# EAGLE design n64cart-v2-soic-8 (EAGLE 9.6.2)
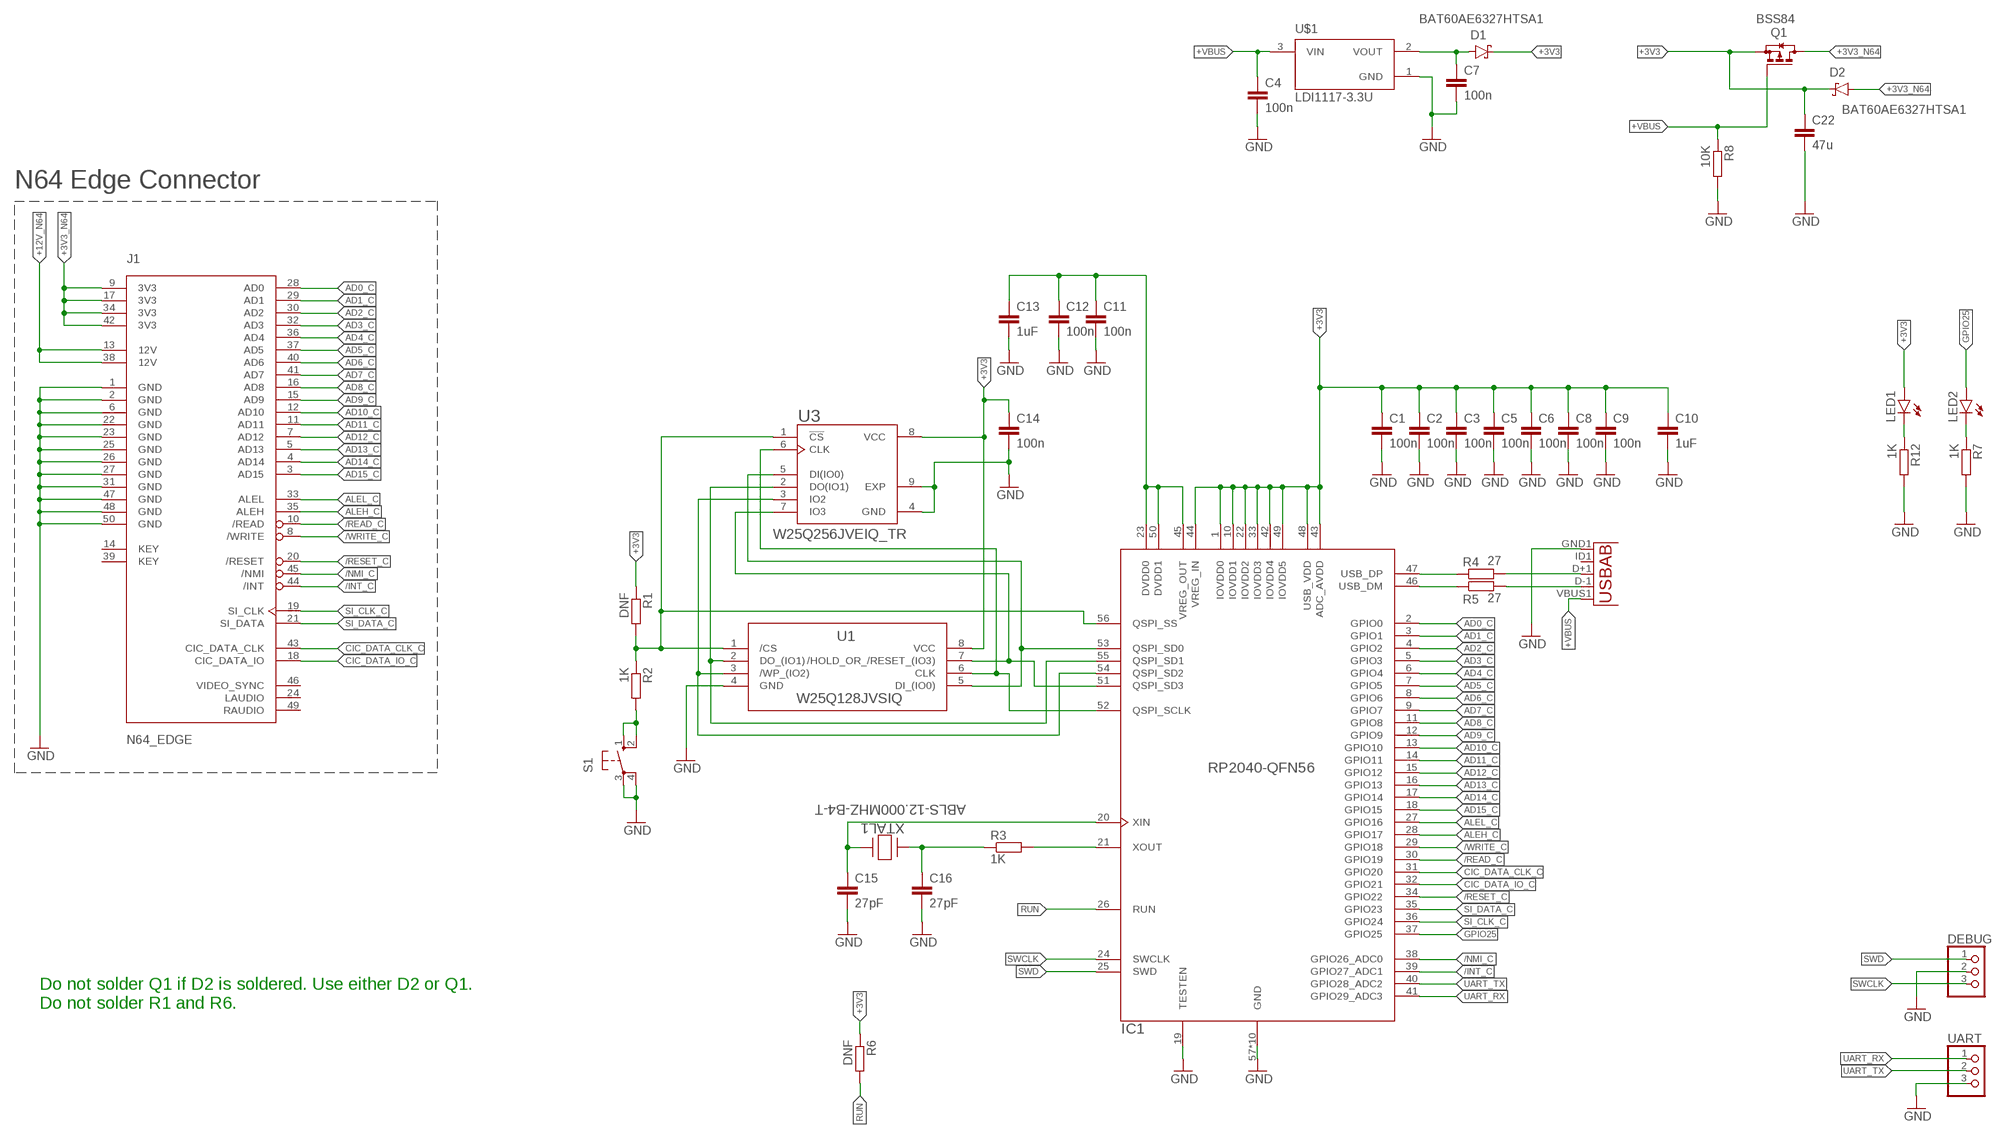
[diagram p0: schematic, sheet 1]

## Parts
C1  100n  C-EUC0402  [C0402]
C2  100n  C-EUC0402  [C0402]
C3  100n  C-EUC0402  [C0402]
C4  100n  C-EUC0402  [C0402]
C5  100n  C-EUC0402  [C0402]
C6  100n  C-EUC0402  [C0402]
C7  100n  C-EUC0402  [C0402]
C8  100n  C-EUC0402  [C0402]
C9  100n  C-EUC0402  [C0402]
C10  1uF  C-EUC0402  [C0402]
C11  100n  C-EUC0402  [C0402]
C12  100n  C-EUC0402  [C0402]
C13  1uF  C-EUC0402  [C0402]
C14  100n  C-EUC0402  [C0402]
C15  27pF  C-EUC0402  [C0402]
C16  27pF  C-EUC0402  [C0402]
C22  47u  C-EUC0805  [C0805]
D1  BAT60AE6327HTSA1  BAT60J  [SOD323_ST]
D2  BAT60AE6327HTSA1  BAT60J  [SOD323_ST]
DEBUG  PINHD-1X3  [1X03]
IC1  RP2040-QFN56  [RP2040-QFN-56]
J1  N64_EDGE  [N64_EDGE]
LED1  LED5MM  [LED5MM]
LED2  LED5MM  [LED5MM]
Q1  BSS84  [SOT23]
R1  DNF  R-EU_R0402  [R0402]
R2  1K  R-EU_R0402  [R0402]
R3  1K  R-EU_R0402  [R0402]
R4  27  R-EU_R0402  [R0402]
R5  27  R-EU_R0402  [R0402]
R6  DNF  R-EU_R0402  [R0402]
R7  1K  R-EU_R0402  [R0402]
R8  10K  R-EU_R0402  [R0402]
R12  1K  R-EU_R0402  [R0402]
S1  10-XX  [B3F-10XX]
U1  W25Q128JVSIQ  [SOIC_128JVSIQ_WIN]
U2  USB""  [USB-MICRO-SMD]
U3  W25Q256JVEIQ_TR  [SON127P800X600X80-9N]
U$1  LDI1117-3.3U  [LDI1117-3.3U]
UART  PINHD-1X3  [1X03]
XTAL1  ABLS-12.000MHZ-B4-T  [XTAL_ABLS_ABR]

## Nets
+3V3: C1.1 C2.1 C3.1 C5.1 C6.1 C8.1 C9.1 C10.1 C14.1 C22.1 D1.C D2.C IC1.1(IOVDD0) IC1.10(IOVDD1) IC1.22(IOVDD2) IC1.33(IOVDD3) IC1.42(IOVDD4) IC1.43(ADC_AVDD) IC1.44(VREG_IN) IC1.48(USB_VDD) IC1.49(IOVDD5) LED1.A Q1.2(S) R1.1 R6.1 U1.8(VCC) U3.8(VCC)
+3V3_N64: D2.A J1.9(3V3) J1.17(3V3) J1.34(3V3) J1.42(3V3) Q1.3(D)
+12V_N64: J1.13(12V) J1.38(12V)
+VBUS: C4.1 Q1.1(G) R8.1 U2.VBUS1(VBUS) U$1.3(VIN)
/INT_C: IC1.39(GPIO27_ADC1) J1.44(/INT)
/NMI_C: IC1.38(GPIO26_ADC0) J1.45(/NMI)
/READ_C: IC1.30(GPIO19) J1.10(/READ)
/RESET_C: IC1.34(GPIO22) J1.20(/RESET)
/WRITE_C: IC1.29(GPIO18) J1.8(/WRITE)
AD0_C: IC1.2(GPIO0) J1.28(AD0)
AD1_C: IC1.3(GPIO1) J1.29(AD1)
AD2_C: IC1.4(GPIO2) J1.30(AD2)
AD3_C: IC1.5(GPIO3) J1.32(AD3)
AD4_C: IC1.6(GPIO4) J1.36(AD4)
AD5_C: IC1.7(GPIO5) J1.37(AD5)
AD6_C: IC1.8(GPIO6) J1.40(AD6)
AD7_C: IC1.9(GPIO7) J1.41(AD7)
AD8_C: IC1.11(GPIO8) J1.16(AD8)
AD9_C: IC1.12(GPIO9) J1.15(AD9)
AD10_C: IC1.13(GPIO10) J1.12(AD10)
AD11_C: IC1.14(GPIO11) J1.11(AD11)
AD12_C: IC1.15(GPIO12) J1.7(AD12)
AD13_C: IC1.16(GPIO13) J1.5(AD13)
AD14_C: IC1.17(GPIO14) J1.4(AD14)
AD15_C: IC1.18(GPIO15) J1.3(AD15)
ALEH_C: IC1.28(GPIO17) J1.35(ALEH)
ALEL_C: IC1.27(GPIO16) J1.33(ALEL)
CIC_DATA_CLK_C: IC1.31(GPIO20) J1.43(CIC_DATA_CLK)
CIC_DATA_IO_C: IC1.32(GPIO21) J1.18(CIC_DATA_IO)
GND: C1.2 C2.2 C3.2 C4.2 C5.2 C6.2 C7.2 C8.2 C9.2 C10.2 C11.2 C12.2 C13.2 C14.2 C15.2 C16.2 C22.2 DEBUG.2 IC1.19(TESTEN) IC1.57(GND) IC1.58(GND) IC1.59(GND) IC1.60(GND) IC1.61(GND) IC1.62(GND) IC1.63(GND) IC1.64(GND) IC1.65(GND) IC1.66(GND) J1.1(GND) J1.2(GND) J1.6(GND) J1.22(GND) J1.23(GND) J1.25(GND) J1.26(GND) J1.27(GND) J1.31(GND) J1.47(GND) J1.48(GND) J1.50(GND) R7.2 R8.2 R12.2 S1.3(P) S1.4(P1) U1.4(GND) U2.GND1(GND) U3.4(GND) U3.9(EXP) U$1.1(GND) UART.3
GPIO25: IC1.37(GPIO25) LED2.A
N$1: C7.1 D1.A U$1.2(VOUT)
N$2: R5.2 U2.D-1(D-)
N$3: R4.2 U2.D+1(D+)
N$4: LED2.K(C) R7.1
N$5: C11.1 C12.1 C13.1 IC1.23(DVDD0) IC1.45(VREG_OUT) IC1.50(DVDD1)
N$6: LED1.K(C) R12.1
N$9: IC1.53(QSPI_SD0) U1.5(DI_(IO0)) U3.5(DI(IO0))
N$11: IC1.51(QSPI_SD3) U1.7(/HOLD_OR_/RESET_(IO3)) U3.7(IO3)
N$12: IC1.52(QSPI_SCLK) U1.6(CLK) U3.6(CLK)
N$13: IC1.56(QSPI_SS) R1.2 R2.1 U1.1(/CS) U3.1(!CS)
N$14: IC1.55(QSPI_SD1) U1.2(DO_(IO1)) U3.2(DO(IO1))
N$15: IC1.54(QSPI_SD2) U1.3(/WP_(IO2)) U3.3(IO2)
N$16: R2.2 S1.1(S) S1.2(S1)
N$17: C16.1 R3.1 XTAL1.1
N$18: C15.1 IC1.20(XIN) XTAL1.2
N$19: IC1.21(XOUT) R3.2
N$20: IC1.47(USB_DP) R4.1
N$21: IC1.46(USB_DM) R5.1
RUN: IC1.26(RUN) R6.2
SI_CLK_C: IC1.36(GPIO24) J1.19(SI_CLK)
SI_DATA_C: IC1.35(GPIO23) J1.21(SI_DATA)
SWCLK: DEBUG.3 IC1.24(SWCLK)
SWD: DEBUG.1 IC1.25(SWD)
UART_RX: IC1.41(GPIO29_ADC3) UART.1
UART_TX: IC1.40(GPIO28_ADC2) UART.2
Unconnected: J1.14(KEY) J1.24(LAUDIO) J1.39(KEY) J1.46(VIDEO_SYNC) J1.49(RAUDIO) U2.ID1(USBID)

## Notes on the sheet
- N64 Edge Connector
- Do not solder Q1 if D2 is soldered. Use either D2 or Q1.
  Do not solder R1 and R6.

## Library data of the parts
C1-C16 C22 = rcl:C-EU: CAPACITOR, European symbol; SPICEPREFIX: C
D1 D2 = diode:BAT60J: Schottky barrier diode Source: www.st.com, BAT60J.pdf
DEBUG UART = pinhead:PINHD-1X3: PIN HEADER
IC1 = RpiPico:RP2040-QFN56
J1 = SummerCart64:N64_EDGE: Nintendo 64 cartridge edge connector.
LED1 LED2 = led:LED: LED OSRAM: - CHIPLED LG R971, LG N971, LY N971, LG Q971, LY Q971, LO R971, LY R971 LH N974, LH R974 LS Q976, LO Q976, LY Q976 LO Q996 - Hyper CHIPLED LW Q18S LB Q993, LB Q99A, LB R99A - SideLED LS A670, LO A670, LY A670, LG A670, LP A670 LB A673, LV A673, LT A673, LW A673 LH A674 LY A675 LS A676, LA A676, LO A676, LY A676, LW A676 LS A679, LY A679, LG A679 - Hyper Micro SIDELED® LS Y876, LA Y876, LO Y876, LY Y876 LT Y87S - SmartLED LW L88C, LW L88S LB L89C, LB L89S, LG L890 LS L89K, LO L89K, LY L89K LS L896, LA L896, LO L896, LY L896 - TOPLED LS T670, LO T670, LY T670, LG T670, LP T670 LSG T670, LSP T670, LSY T670, LOP T670, LYG T670 LG T671, LOG T671, LSG T671 LB T673, LV T673, LT T673, LW T673 LH T674 LS T676, LA T676, LO T676, LY T676, LB T676, LH T676, LSB T676, LW T676 LB T67C, LV T67C, LT T67C, LS T67K, LO T67K, LY T67K, LW E67C LS E67B, LA E67B, LO E67B, LY E67B, LB E67C, LV E67C, LT E67C LW T67C LS T679, LY T679, LG T679 LS T770, LO T770, LY T770, LG T770, LP T770 LB T773, LV T773, LT T773, LW T773 LH T774 LS E675, LA E675, LY E675, LS T675 LS T776, LA T776, LO T776, LY T776, LB T776 LHGB T686 LT T68C, LB T68C - Hyper Mini TOPLED® LB M676 - Mini TOPLED Santana® LG M470 LS M47K, LO M47K, LY M47K Source: http://www.osram.convergy.de LUXEON: - LUMILED® LXK2-PW12-R00, LXK2-PW12-S00, LXK2-PW14-U00, LXK2-PW14-V00 LXK2-PM12-R00, LXK2-PM12-S00, LXK2-PM14-U00 LXK2-PE12-Q00, LXK2-PE12-R00, LXK2-PE12-S00, LXK2-PE14-T00, LXK2-PE14-U00 LXK2-PB12-K00, LXK2-PB12-L00, LXK2-PB12-M00, LXK2-PB14-N00, LXK2-PB14-P00, LXK2-PB14-Q00 LXK2-PR12-L00, LXK2-PR12-M00, LXK2-PR14-Q00, LXK2-PR14-R00 LXK2-PD12-Q00, LXK2-PD12-R00, LXK2-PD12-S00 LXK2-PH12-R00, LXK2-PH12-S00 LXK2-PL12-P00, LXK2-PL12-Q00, LXK2-PL12-R00 Source: www.luxeon.com KINGBRIGHT: KA-3528ASYC Source: www.kingbright.com
Q1 = transistor-small-signal:BSS84: P-CHANNEL MOS FET
R1-R8 R12 = rcl:R-EU_: RESISTOR, European symbol; SPICEPREFIX: R
S1 = switch-omron:10-XX: OMRON SWITCH; MPN: B3F-1000; OC_FARNELL: 176432; OC_NEWARK: 36M3542
U1 = w25q256-soic:W25Q128JVSIQ; COPYRIGHT: Copyright (C) 2022 Ultra Librarian. All rights reserved.; DIGI-KEY_PART_NUMBER_1: W25Q128JVSIQ-ND; MANUFACTURER_PART_NUMBER: W25Q128JVSIQ; MFR_NAME: Winbond
U2 = MicroUSB:USB: This is a USB AB connector that is compatible with USB OTG. i.e. this connector can serve as a host or device
U3 = W25Q256JVEIQ_TR:W25Q256JVEIQ_TR: Ic Flash 256mbit 104mhz 8wson; DESCRIPTION: FLASH - NOR Memory IC 256Mb (32M x 8) SPI - Quad I/O 133 MHz 8-WSON (8x6); DIGI-KEY_PART_NUMBER: W25Q256JVEIQTR-ND; MF: Winbond; MP: W25Q256JVEIQ TR; PACKAGE: WSON-8 Winbond; PURCHASE-URL: https://pricing.snapeda.com/search/part/W25Q256JVEIQ TR/?ref=eda
U$1 = LDI1117-3.3U:LDI1117-3.3U
XTAL1 = abls-12.000MHZ-B4-T:ABLS-12.000MHZ-B4-T; COPYRIGHT: Copyright (C) 2022 Ultra Librarian. All rights reserved.; MANUFACTURER_PART_NUMBER: ABLS-12.000MHZ-B4-T; MFR_NAME: Abracon

## Board
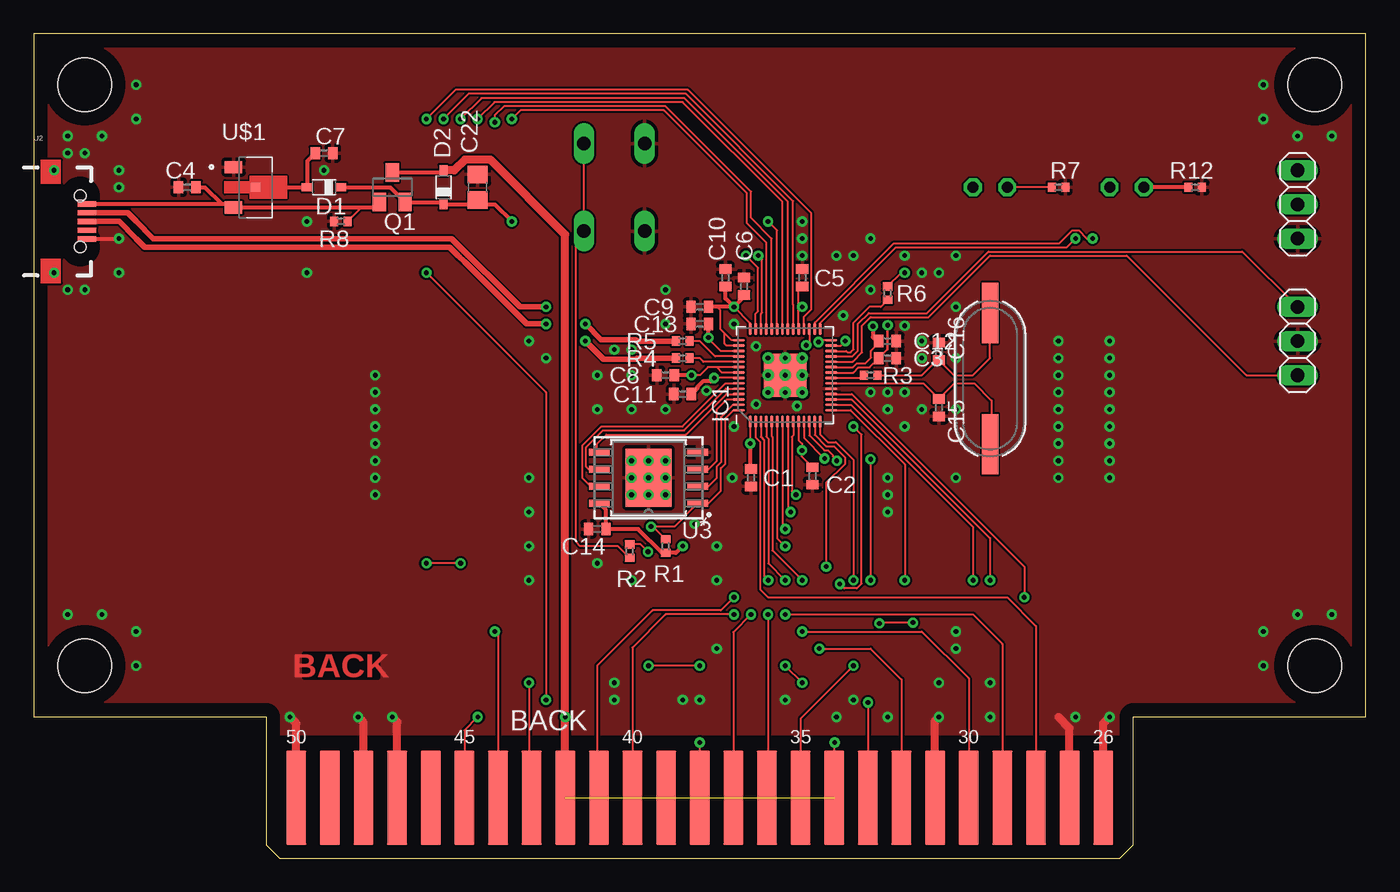
[diagram p1: board, top side]
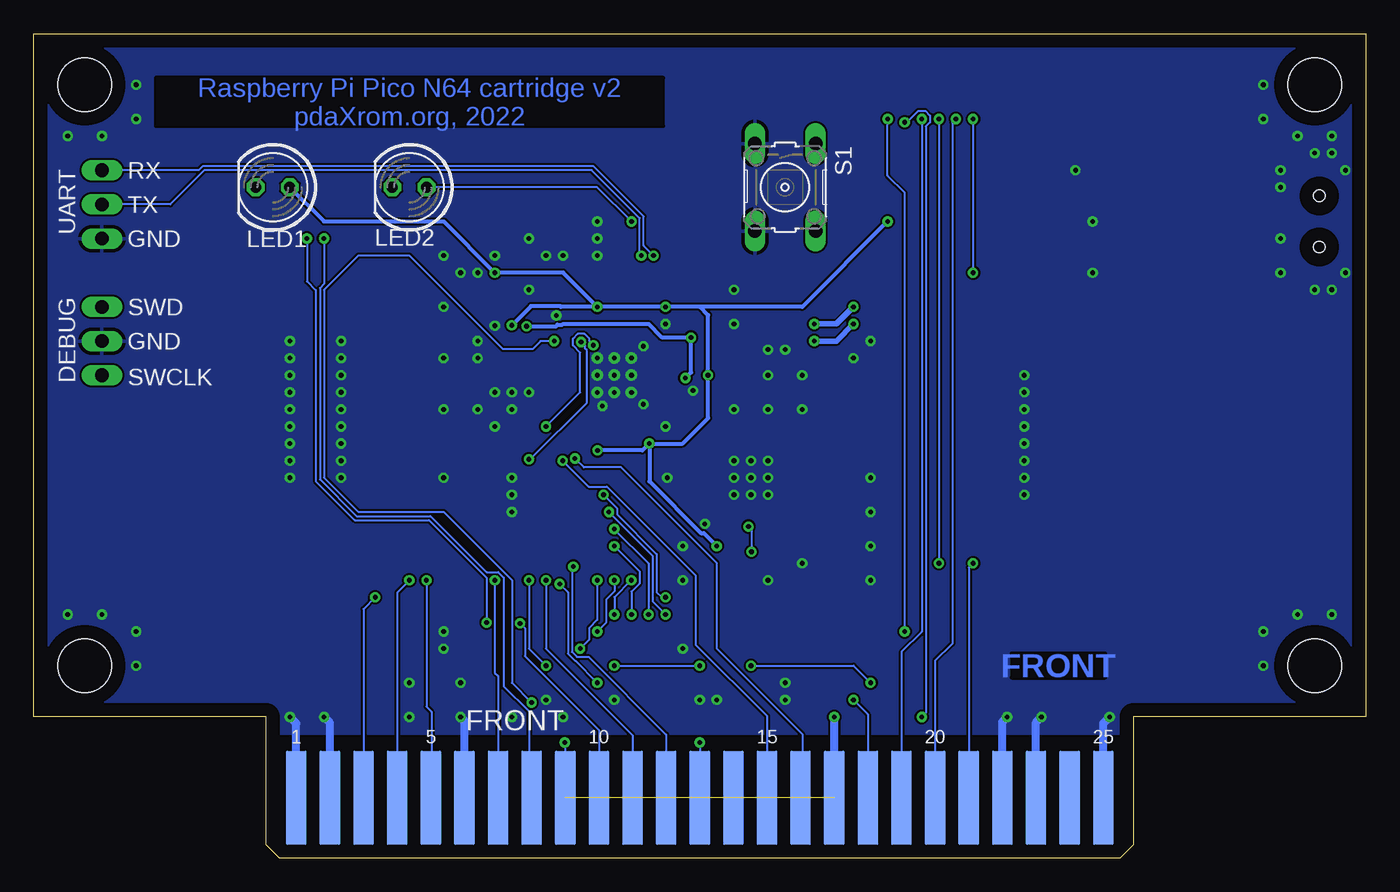
[diagram p2: board, bottom side, seen from below]

Size 99.06 x 61.29 mm. Coordinates in mm from the lower left corner, seen from the top.
Outline: 17.27,10.5 0,10.5 0,61.29 99.06,61.29 99.06,10.5 81.79,10.5
Copper layers (1*16): Top 0.035mm / dielectric 1.5mm / Bottom 0.035mm
Design rules "default *": minimum track width 6mil, minimum drill 0.35mm, track to track 6mil, track to pad 6mil, pad to pad 6mil, via to via 6mil, smd to smd 6mil, copper to edge 40mil, drill to drill 6mil, minimum pad ring 10mil, minimum via ring 8mil, stop-mask expansion 4mil, vias tented up to drill 0.4mm, thermal gap 10mil
Holes 4 mm at 3.81,14.31 95.25,14.31 95.25,57.49 3.81,57.49

### Footprints (pad centres in the part's own frame; a part is rotated, then mirrored left to right if it is on the bottom)
C0402 = smd 0.7 x 0.9: 1 -0.65,0; 2 0.65,0
C0805 = smd 1.3 x 1.5: 1 -0.95,0; 2 0.95,0
SOD323_ST = smd 0.8 x 0.6: A 1.25,0; C -1.25,0
1X03 = drill 1.016 long: 1 -2.54,0; 2 0,0; 3 2.54,0
RP2040-QFN-56 = smd 0.875 x 0.2: 1 -3.438,2.6; 2 -3.438,2.2; 3 -3.438,1.8; 4 -3.438,1.4; 5 -3.438,1; 6 -3.438,0.6; 7 -3.438,0.2; 8 -3.438,-0.2; 9 -3.438,-0.6; 10 -3.438,-1; 11 -3.438,-1.4; 12 -3.438,-1.8; 13 -3.438,-2.2; 14 -3.438,-2.6; 29 3.438,-2.6; 30 3.438,-2.2; 31 3.438,-1.8; 32 3.438,-1.4; 33 3.438,-1; 34 3.438,-0.6; 35 3.438,-0.2; 36 3.438,0.2; 37 3.438,0.6; 38 3.438,1; 39 3.438,1.4; 40 3.438,1.8; 41 3.438,2.2; 42 3.438,2.6 | smd 0.2 x 0.875: 15 -2.6,-3.438; 16 -2.2,-3.438; 17 -1.8,-3.438; 18 -1.4,-3.438; 19 -1,-3.438; 20 -0.6,-3.438; 21 -0.2,-3.438; 22 0.2,-3.438; 23 0.6,-3.438; 24 1,-3.438; 25 1.4,-3.438; 26 1.8,-3.438; 27 2.2,-3.438; 28 2.6,-3.438; 43 2.6,3.438; 44 2.2,3.438; 45 1.8,3.438; 46 1.4,3.438; 47 1,3.438; 48 0.6,3.438; 49 0.2,3.438; 50 -0.2,3.438; 51 -0.6,3.438; 52 -1,3.438; 53 -1.4,3.438; 54 -1.8,3.438; 55 -2.2,3.438; 56 -2.6,3.438 | smd 3.2 x 3.2: 57 0,0 | drill 0.35 pad 0.6: 58 -1.275,1.275; 59 0,1.275; 60 1.275,1.275; 61 -1.275,0; 62 0,0; 63 1.275,0; 64 -1.275,-1.275; 65 0,-1.275; 66 1.275,-1.275
N64_EDGE = smd 1.5 x 7 bottom: 1 30,-6; 2 27.5,-6; 3 25,-6; 4 22.5,-6; 5 20,-6; 6 17.5,-6; 7 15,-6; 8 12.5,-6; 9 10,-6; 10 7.5,-6; 11 5,-6; 12 2.5,-6; 13 0,-6; 14 -2.5,-6; 15 -5,-6; 16 -7.5,-6; 17 -10,-6; 18 -12.5,-6; 19 -15,-6; 20 -17.5,-6; 21 -20,-6; 22 -22.5,-6; 23 -25,-6; 24 -27.5,-6; 25 -30,-6 | smd 1.5 x 7: 26 30,-6; 27 27.5,-6; 28 25,-6; 29 22.5,-6; 30 20,-6; 31 17.5,-6; 32 15,-6; 33 12.5,-6; 34 10,-6; 35 7.5,-6; 36 5,-6; 37 2.5,-6; 38 0,-6; 39 -2.5,-6; 40 -5,-6; 41 -7.5,-6; 42 -10,-6; 43 -12.5,-6; 44 -15,-6; 45 -17.5,-6; 46 -20,-6; 47 -22.5,-6; 48 -25,-6; 49 -27.5,-6; 50 -30,-6
LED5MM = drill 0.813 octagon: A -1.27,0; K 1.27,0
SOT23 = smd 1 x 1.4: 1 -0.95,-1.1; 2 0.95,-1.1; 3 0,1.1
R0402 = smd 0.6 x 0.7: 1 -0.5,0; 2 0.5,0
B3F-10XX = drill 1.016 long: 1 -3.251,2.261; 2 3.251,2.261; 3 -3.251,-2.261; 4 3.251,-2.261
SOIC_128JVSIQ_WIN = smd 1.524 x 0.533: 1 -3.645,1.905; 2 -3.645,0.635; 3 -3.645,-0.635; 4 -3.645,-1.905; 5 3.645,-1.905; 6 3.645,-0.635; 7 3.645,0.635; 8 3.645,1.905
USB-MICRO-SMD = smd 1.4 x 0.4: D+1 2.7,0; D-1 2.7,0.65; GND1 2.7,-1.3; ID1 2.7,-0.65; VBUS1 2.7,1.3 | hole 0.85: 2.2,1.9; 2.2,-1.9
SON127P800X600X80-9N = smd 0.94 x 0.44: 1 -3.895,1.905; 2 -3.895,0.635; 3 -3.895,-0.635; 4 -3.895,-1.905; 5 3.895,-1.905; 6 3.895,-0.635; 7 3.895,0.635; 8 3.895,1.905 | smd 3.4 x 4.3: 9 0,0
LDI1117-3.3U = smd 1.3 x 0.9: 1 -1.65,1.5; 3 -1.65,-1.5 | smd 0.7 x 0.7: 2 0,0
XTAL_ABLS_ABR = smd 4.47 x 1.219: 1 -4.877,0; 2 4.877,0

### Placement (x,y rotation side)
C1  53.34,28.28 270 top
C2  57.91,28.41 270 top
C3  63.5,37.17 0 top
C4  11.43,49.87 180 top
C5  57.15,43.14 90 top
C6  52.83,42.5 90 top
C7  21.59,52.41 0 top
C8  46.99,35.9 180 top
C9  49.53,40.98 180 top
C10  51.44,43.14 90 top
C11  48.26,34.5 180 top
C12  63.5,38.44 0 top
C13  49.53,39.71 180 top
C14  41.91,24.47 180 top
C15  67.31,33.49 270 top
C16  67.31,37.68 90 top
C22  33.02,49.87 90 top
D1  21.59,49.87 180 top
D2  30.48,49.87 90 top
DEBUG  93.98,38.44 270 top
IC1  55.88,35.9 90 top
J1  49.53,10.5 0 top
LED1  81.28,49.87 180 bottom
LED2  71.12,49.87 180 bottom
Q1  26.67,49.87 0 top
R1  46.99,23.2 90 top
R2  44.32,22.82 270 top
R3  62.23,35.9 180 top
R4  48.26,37.17 180 top
R5  48.26,38.44 180 top
R6  63.5,42 270 top
R7  76.2,49.87 0 top
R8  22.86,47.33 180 top
R12  86.36,49.87 0 top
S1  43.18,49.87 270 bottom
U1  45.72,28.28 180 top
U2  1.27,47.33 0 top
U3  45.72,28.28 180 top
U$1  16.51,49.87 0 top
UART  93.98,48.6 270 top
XTAL1  71.12,35.65 270 top

### Tracks (layer width: path | path; a pad name or v marks a point on that pad's centre or on a via)
+3V3  (via drill 0.35)
  Top 0.152: 50.43,40.98 C9.1 50.8,40.98 51.05,40.73 51.05,39.33 51.37,39.01 | IC1.33 56.88,41.25 | C5.1 56.88,42.22 56.88,41.25 | IC1.22 60.96,36.1 61.34,36.48 62.16,36.48 C3.1 | IC1.1 v53.28,30.82 | IC1.48 50.8,36.5 | 50.8,36.5 50.13,36.5 49.53,35.9 v48.91,35.9 | IC1.49 51.2,36.1 50.8,36.5 | v57.15,40.98 56.88,41.25 | v64.77,43.52 64.52,43.52 R6.1 | IC1.10 56.88,31.07 57.13,30.82 v57.13,30.31 57.13,29.84 C2.1 | IC1.43 51.88,38.5 51.37,39.01 | IC1.44 51.52,38.1 51.37,38.25 51.37,39.01 | U1.8 U3.8 | v52.07,40.98 53.28,39.77 IC1.42
  Top 0.203: v63.5,39.61 63.5,37.82 C3.1
  Top 0.305: D1.C 26.52,49.87 Q1.2 30.33,48.77 D2.C 32.72,48.62 C22.1 33.34,48.6 34.29,48.6 v35.56,47.33 | v48.91,35.9 C8.1 | v52.07,40.98 C9.1 | v52.07,40.98 51.44,41.62 C10.1 | v52.07,40.98 52.83,41.74 C6.1 | v53.28,30.82 53.28,28.99 C1.1 | v48.26,23.2 47.76,22.7 R1.1 46.72,22.7 44.95,24.47 C14.1 42.56,25.89 U1.8
  Bottom 0.305: v35.56,47.33 41.91,40.98 49.53,40.98 | 49.53,40.98 v52.07,40.98 v57.15,40.98 | LED1.A 77.47,47.33 68.58,47.33 v64.77,43.52 59.69,43.52 v57.15,40.98 | v57.15,40.98 59.87,40.98 59.91,41.03 62.08,41.03 v63.5,39.61 | 49.53,40.98 48.91,40.36 v48.91,35.9 48.91,32.71 50.8,30.82 v53.28,30.82 | v53.28,30.82 53.79,30.31 v57.13,30.31 | v48.26,23.2 49.23,24.17 49.43,24.17 53.28,28.02 v53.28,30.82
+3V3_N64  (via drill 0.35)  (1 unrouted)
  Top 0.152: 59.53,4.63 J1.34 59.53,8.56 v59.56,8.6
  Top 0.305: Q1.3 30.33,50.97 D2.A
  Top 0.61: J1.42 v39.53,10.5 39.53,46.36 33.96,51.93 32.08,51.93 31.27,51.12 D2.A
  Bottom 0.152: J1.34 59.53,4.63 59.56,4.66 v59.56,8.6
  Bottom 0.61: J1.42 v39.53,10.5
+12V_N64  (via drill 0.35)
  Top 0.152: J1.38 v49.53,8.6
  Bottom 0.152: v49.53,8.6 J1.38
+VBUS
  Top 0.152: R8.1 24.4,48.37 25.32,48.37
  Top 0.305: U2.VBUS1 13.97,48.63 | 13.97,48.63 14.6,48.63 U$1.3 25.32,48.37 Q1.1 | C4.1 12.73,49.87 13.97,48.63
/INT_C  (via drill 0.35)
  Top 0.152: IC1.39 54.48,45.76 53.03,47.2 53.03,49.41 46.86,55.59 36.2,55.59 v35.56,54.95 | v34.29,16.85 34.53,16.61 J1.44
  Bottom 0.152: v35.56,54.95 35.56,50.73 34.29,49.46 v34.29,16.85
/NMI_C  (via drill 0.35)
  Top 0.152: IC1.38 54.88,46.06 53.34,47.6 53.34,49.54 46.99,55.89 34.97,55.89 34.29,55.21 v34.29,54.7 | v33.02,10.5 32.03,9.51 J1.45
  Bottom 0.152: v34.29,54.7 34.13,54.7 33.27,55.56 32.77,55.56 32.41,55.2 32.41,54.7 32.72,54.4 32.72,10.8 v33.02,10.5
/READ_C  (via drill 0.35)
  Top 0.152: IC1.30 58.08,39.8 63.98,45.7 76.26,45.7 77.22,46.67 77.72,46.67 78.33,46.06 v78.74,46.06 | v65.38,17.51 62.95,17.51 v62.89,17.46
  Bottom 0.152: v78.74,46.06 78.74,42.88 78.08,42.23 78.08,28.03 75.18,25.13 69.67,25.13 65.38,20.84 v65.38,17.51 | v62.89,17.46 62.53,17.1 62.53,15.03 57.03,9.52 J1.10
/RESET_C  (via drill 0.35)
  Top 0.152: IC1.34 56.48,41.15 56.47,41.16 56.47,48.85 48.52,56.8 32.33,56.8 v30.48,54.95
  Bottom 0.152: v30.48,54.95 30.76,54.67 30.76,15.93 32.03,14.66 J1.20
/WRITE_C  (via drill 0.35)
  Top 0.152: IC1.29 58.48,39.77 64.11,45.4 76.81,45.4 v77.47,46.06
  Bottom 0.152: v77.47,46.06 77.47,42.68 77.78,42.38 77.78,28.15 75.06,25.43 69.55,25.43 65.38,21.27 64.52,21.27 64.11,20.86 64.11,12.79 62.23,10.91 62.23,4.15 62.03,4.35 J1.8
AD0_C
  Top 0.152: IC1.2 53.68,31.28 54.02,30.94 54.02,19.98 54.61,19.39 72.39,19.39 74.53,17.25 J1.28
AD1_C  (via drill 0.35)
  Top 0.152: IC1.3 54.08,31.31 54.32,31.07 54.32,20.95 54.61,20.66 v54.62,20.66 | v55.88,18.12 69.85,18.12 72.03,15.94 J1.29
  Bottom 0.152: v54.62,20.66 55.88,19.41 v55.88,18.12
AD2_C  (via drill 0.35)
  Top 0.152: v55.88,20.66 54.63,21.91 54.63,31.19 54.48,31.34 IC1.4 | v57.15,16.85 66.04,16.85 69.53,13.36 J1.30
  Bottom 0.152: v55.88,20.66 55.88,19.84 56.49,19.23 56.49,17.51 v57.15,16.85
AD3_C  (via drill 0.35)
  Top 0.152: IC1.5 54.88,31.37 54.93,31.32 54.93,22.88 v57.15,20.66 | v58.42,15.58 62.23,15.58 64.53,13.28 J1.32
  Bottom 0.152: v58.42,15.58 57.76,16.24 57.76,17.1 57.15,17.71 v57.15,20.66
AD4_C  (via drill 0.35)
  Top 0.152: IC1.6 55.28,23.8 v55.88,23.2 | v54.61,18.12 54.61,4.58 J1.36
  Bottom 0.152: v54.61,18.12 54.61,19.82 54.02,20.41 54.02,21.34 v55.88,23.2
AD5_C  (via drill 0.35)
  Top 0.152: IC1.7 55.68,24.68 v55.89,24.47 | J1.37 52.03,16.81 v53.34,18.12
  Bottom 0.152: v55.89,24.47 53.34,21.92 v53.34,18.12
AD6_C  (via drill 0.35)
  Top 0.152: IC1.8 56.08,25.95 v56.29,25.74 | v52.07,18.12 46.99,18.12 44.53,15.66 J1.40
  Bottom 0.152: v52.07,18.12 53.03,19.09 53.03,22.48 56.29,25.73 v56.29,25.74
AD7_C  (via drill 0.35)
  Top 0.152: IC1.9 56.48,31.42 56.38,31.33 56.38,27.31 v56.69,27.01 | v52.07,19.39 51.1,18.43 46.02,18.43 41.91,14.31 41.91,4.62 J1.41
  Bottom 0.152: v56.69,27.01 55.68,26 55.68,25.55 52.73,22.6 52.73,19.77 52.35,19.39 v52.07,19.39
AD8_C  (via drill 0.35)
  Top 0.152: IC1.11 57.28,31.24 v58.81,29.71
  Bottom 0.152: J1.16 41.91,4.62 41.91,9.23 48.26,15.58 48.26,21.93 55.37,29.04 58.15,29.04 v58.81,29.71
AD9_C  (via drill 0.35)
  Top 0.152: IC1.12 57.68,31.43 58.8,30.31 59.07,30.31 59.42,29.96 59.42,29.85 v59.72,29.55
  Bottom 0.152: v59.72,29.55 57.79,27.62 56.44,27.62 49.84,21.02 49.84,15.89 44.53,10.58 J1.15
AD10_C  (via drill 0.35)
  Top 0.152: IC1.13 58.08,31.46 58.93,30.62 59.51,30.62 60.33,29.8 60.33,29.3 58.93,27.9 v58.93,21.68
  Bottom 0.152: v58.93,21.68 59.03,21.58 59.03,15.33 58.67,14.97 57.81,14.97 52.03,9.19 J1.12
AD11_C  (via drill 0.35)
  Top 0.152: IC1.14 58.48,31.49 59.05,30.92 59.64,30.92 60.96,29.6 v60.96,20.66
  Bottom 0.152: v60.96,20.66 60.96,15.58 54.53,9.15 J1.11
AD12_C  (via drill 0.35)
  Top 0.152: IC1.15 60.74,33.3 64.77,29.27 v64.77,20.66
  Bottom 0.152: v64.77,20.66 64.77,13.8 64.52,13.55 64.52,4.51 J1.7
AD13_C  (via drill 0.35)
  Top 0.152: IC1.16 60.77,33.7 69.85,24.62 v69.85,20.66
  Bottom 0.152: v69.85,20.66 69.85,11.26 69.47,10.88 69.47,4.56 J1.5
AD14_C  (via drill 0.35)
  Top 0.152: IC1.17 60.8,34.1 71.12,23.79 v71.12,20.66
  Bottom 0.152: v71.12,20.66 72.03,19.75 J1.4
AD15_C  (via drill 0.35)
  Top 0.152: IC1.18 60.84,34.5 73.66,21.68 v73.66,19.39
  Bottom 0.152: v73.66,19.39 74.53,18.52 J1.3
ALEH_C  (via drill 0.35)
  Top 0.152: v62.23,29.65 v62.23,20.66 | v60.96,14.31 57.03,10.38 J1.35 | IC1.28 58.48,38.5 v58.35,38.37
  Bottom 0.152: v62.23,29.65 62.13,29.65 57.91,33.87 57.91,37.75 58.05,37.88 58.05,38.07 v58.35,38.37 | v62.23,20.66 62.23,15.58 v60.96,14.31
ALEL_C  (via drill 0.35)
  Top 0.152: v62.03,11.57 J1.33 | IC1.27 60.01,38.1 v60.35,38.44
  Bottom 0.152: v60.35,38.44 61.37,38.44 61.98,37.83 64.16,37.83 71.12,44.79 74.93,44.79 77.47,42.25 77.47,28.28 74.93,25.74 68.56,25.74 63.5,20.68 63.5,13.04 v62.03,11.57
CIC_DATA_CLK_C  (via drill 0.35)
  Top 0.152: IC1.31 57.68,38.37 v57.44,38.13 | v59.94,20.38 60.27,20.05 61.21,20.05 61.57,20.41 61.57,31.48 v60.96,32.09 | v57.15,13.04 v55.88,14.31 | v49.53,14.31 v45.72,14.31 | v36.83,13.04 36.83,4.7 J1.43
  Bottom 0.152: v57.44,38.13 57.74,38.44 57.74,38.62 58.1,38.98 58.6,38.98 58.96,38.62 58.96,38.12 58.42,37.58 58.42,34.63 v60.96,32.09 | v59.94,20.38 59.33,19.77 59.33,15.2 58.8,14.67 58.78,14.67 v57.15,13.04 | v55.88,14.31 v49.53,14.31 | v45.72,14.31 38.1,14.31 v36.83,13.04
CIC_DATA_IO_C  (via drill 0.35)
  Top 0.152: IC1.32 57.28,40.25 57.83,40.8 57.83,47.92 48.64,57.11 31.37,57.11 v29.21,54.95 | v29.21,43.52 38.1,34.63 v38.1,11.77
  Bottom 0.152: v29.21,54.95 v29.21,43.52 | v38.1,11.77 37.03,10.7 J1.18
GND  (via drill 0.35)
  Top 0.305: U2.GND1 6.32,46.03 v6.35,46.06
  Top 0.61: J1.50 19.53,10.02 v19.05,10.5 | J1.48 24.53,10.1 v24.13,10.5 | J1.47 27.03,10.14 v26.67,10.5 | J1.26 79.53,10.02 v80.01,10.5 | J1.27 77.03,9.67 76.2,10.5 | J1.31 67.03,10.22 v67.31,10.5
  Bottom 0.61: J1.50 19.53,10.02 v19.05,10.5 | J1.48 24.53,10.1 v24.13,10.5 | J1.47 27.03,10.14 v26.67,10.5 | J1.31 67.03,10.22 v67.31,10.5 | J1.27 77.03,10.06 v77.47,10.5 | J1.26 79.53,10.02 v80.01,10.5
  other vias: 44.45,35.9 80.01,35.9 80.01,33.36 68.58,28.28 68.58,40.98 57.15,47.33 57.15,46.06 57.15,44.79 43.18,13.04 43.18,11.77 48.26,11.77 49.53,11.77 55.88,11.77 50.8,23.2 59.69,10.5 60.96,11.77 63.5,10.5 67.31,13.04 68.58,16.85 68.58,15.58 71.12,13.04 71.12,10.5 7.62,57.49 7.62,54.95 5.08,53.68 2.54,53.68 2.54,18.12 5.08,18.12 7.62,16.85 7.62,14.31 2.54,52.41 3.81,52.41 6.35,51.14 6.35,49.87 6.35,43.52 3.81,42.25 2.54,42.25 96.52,53.68 93.98,53.68 91.44,54.95 91.44,57.49 91.44,14.31 91.44,16.85 93.98,18.12 96.52,18.12 25.4,30.82 25.4,32.09 25.4,33.36 25.4,34.63 25.4,35.9 25.4,29.55 25.4,28.28 25.4,27.01 80.01,38.44 80.01,37.17 80.01,34.63 80.01,32.09 80.01,30.82 80.01,29.55 80.01,28.28 76.2,28.28 76.2,29.55 76.2,30.82 76.2,32.09 76.2,33.36 76.2,34.63 76.2,35.9 76.2,37.17 76.2,38.44 52.07,32.09 53.72,33.74 56.77,33.61 53.72,38.06 66.04,43.52 67.31,43.52 66.04,38.44 59.69,44.79 46.99,42.25 46.99,39.71 45.72,28.28 46.99,33.36 49.15,24.85 36.83,38.44 38.1,37.17 45.72,29.55 41.91,35.9 45.72,27.01 41.91,33.36 44.45,33.36 44.45,20.66 41.91,21.93 36.83,20.66 36.83,23.2 36.83,25.74 36.83,28.28 63.5,33.36 64.77,32.09 62.23,34.63 63.5,28.28 63.5,27.01 63.5,25.74 1.52,51.14 1.52,43.52 50.8,20.66 50.8,15.58 62.23,42.25 60.2,40.34 44.45,37.8 43.18,37.8 66.04,37.17 68.58,37.17 68.58,33.36 63.5,34.63 64.77,34.63 66.04,33.36 44.45,29.55 44.45,28.28 44.45,27.01 46.99,27.01 46.99,28.28 46.99,29.55 64.77,39.58 51.94,28.28 52.07,39.71 60.96,44.79 62.23,46.06 64.77,44.79 68.58,44.79 50.04,34.76 21.59,51.14 20.32,47.33 20.32,43.52
  pour Top: 0,10.5 17.27,10.5 17.27,9.74 17.78,9.23 81.28,9.23 81.79,9.74 81.79,10.5 99.06,10.5 99.06,61.3 0,61.3
  pour Bottom: 0,61.3 0,10.5 17.27,10.5 17.27,9.74 17.78,9.23 81.28,9.23 81.79,9.74 81.79,10.5 99.06,10.5 99.06,61.3
GPIO25  (via drill 0.35)
  Top 0.152: IC1.37 55.28,46.66 v54.61,47.33
  Bottom 0.152: v54.61,47.33 57.15,49.87 LED2.A
N$1
  Top 0.305: U$1.2 D1.A 20.34,51.81 C7.1
N$2  (via drill 0.35)
  Top 0.152: 6.99,47.97 6.97,47.98 U2.D-1
  Top 0.406: R5.2 44.85,38.44 44.75,38.54 42.19,38.54 v41.02,39.71 | v38.1,40.98 36.17,40.98 31.09,46.06 8.89,46.06 7.62,47.33 6.99,47.97 6.97,47.98 U2.D-1
  Bottom 0.406: v41.02,39.71 39.37,39.71 v38.1,40.98
N$3  (via drill 0.35)
  Top 0.152: v38.1,39.71 36.83,39.71 31.75,44.79
  Top 0.406: R4.2 44.85,37.17 44.75,37.07 42.39,37.07 v41.02,38.44 | U2.D+1 6.35,47.33 7.62,46.06 8.26,45.42 30.93,45.42 31.57,44.79 32.04,44.32 36.65,39.71 v38.1,39.71
  Bottom 0.406: v41.02,38.44 39.37,38.44 v38.1,39.71
N$4
  Top 0.152: R7.1 LED2.K
N$5  (via drill 0.35)
  Top 0.152: IC1.23 60.93,36.5 61.21,36.78 61.84,36.78 62.27,37.21 62.27,37.72 62.85,38.29 | 62.85,38.29 C12.1 62.41,38.88 v62.41,39.54 | 62.7,38.44 62.85,38.29 | v50.18,38.69 50.18,38.63 51.11,37.7 IC1.45 | IC1.50 v50.6,35.7
  Top 0.305: v50.6,35.7 50.34,35.44 49.76,35.44 49.35,35.04 49.35,34.95 C11.1 | v50.18,38.69 C13.1 | v62.41,39.54 62.41,38.74 62.7,38.44
  Bottom 0.152: 60.07,39.71 59.69,39.71
  Bottom 0.305: v50.6,35.7 50.18,36.12 v50.18,38.69 52.32,38.69 53.34,39.71 59.69,39.71 59.74,39.66 60.12,39.66 60.25,39.54 v62.41,39.54
N$6
  Top 0.305: R12.1 LED1.K
N$9
  Top 0.152: IC1.53 51.51,34.5 48.5,31.49 42.58,31.49 41.91,30.82 41.91,30.35 U1.5 41.91,30.34 41.91,30.18 U3.5
N$11
  Top 0.152: IC1.51 51.45,35.3 48.25,32.1 42.21,32.1 40.78,30.67 40.78,28.27 41.4,27.64 U3.7 U1.7
N$12
  Top 0.152: IC1.52 51.48,34.9 48.38,31.8 42.34,31.8 41.08,30.55 41.08,29.11 41.27,28.91 U3.6 U1.6
N$13  (via drill 0.35)
  Top 0.152: U1.1 U3.1 | U1.1 50.16,26.38 51.1,27.32 51.1,28.99 51.41,29.3 51.41,32.67 52.04,33.3 IC1.56 | U1.1 47.64,24.65 v45.9,24.65 46.04,24.65 R1.2 | v45.68,22.77 45.13,23.32 R2.1
  Bottom 0.152: v45.9,24.65 45.68,24.43 v45.68,22.77
N$14
  Top 0.152: U3.2 U1.2 49.69,27.64 50.16,27.64 50.8,28.28 50.8,29.12 51.1,29.42 51.1,32.79 52.01,33.7 IC1.55
N$15
  Top 0.152: IC1.54 51.54,34.1 50.8,33.36 50.8,29.55 50.16,28.91 49.69,28.91 U1.3 U3.3
N$16
  Top 0.152: S1.1 S1.2 40.34,46.04 40.34,23.5 40.64,23.2 43.44,23.2 R2.2
N$17
  Top 0.152: 71.54,42.54 71.12,42.12 XTAL1.1 71.12,37.17 69.85,35.9 68.58,35.9 68.44,35.9 C16.1 67.17,37.03 66.04,35.9 R3.1
N$18
  Top 0.152: XTAL1.2 71.22,30.67 71.22,30.92 | 71.22,30.92 71.49,30.66 71.49,29.31 | IC1.20 66.15,35.3 C15.1 68.47,35.3 68.58,35.3 69.94,35.3 71.22,34.02 71.22,30.92
N$19
  Top 0.152: IC1.21 61.53,35.7 R3.2
N$20
  Top 0.152: IC1.47 49.8,36.9 49.53,37.17 R4.1
N$21
  Top 0.152: IC1.46 50.67,37.3 49.53,38.44 R5.1
RUN
  Top 0.152: IC1.26 60.43,37.7 60.52,37.6 60.74,37.6 60.96,37.83 60.96,39.81 62.13,40.98 62.98,40.98 R6.2
SI_CLK_C  (via drill 0.35)
  Top 0.152: IC1.36 55.68,48.78 48.26,56.2 34.27,56.2 v33.02,54.95
  Bottom 0.152: v33.02,54.95 33.02,16.85 34.53,15.34 J1.19
SI_DATA_C  (via drill 0.35)
  Top 0.152: IC1.35 56.08,48.81 48.39,56.5 33.3,56.5 v31.75,54.95 | v31.75,21.93 v29.21,21.93
  Bottom 0.152: v31.75,54.95 v31.75,21.93 | v29.21,21.93 29.53,21.61 J1.21
SWCLK
  Top 0.152: IC1.24 59.33,36.92 60.91,36.92 61.59,37.6 61.59,39.58 62.23,40.22 66.55,40.22 71.12,44.79 81.28,44.79 90.17,35.9 DEBUG.3
SWD
  Top 0.152: IC1.25 60.83,37.3 60.85,37.28 61.29,37.73 61.29,39.71 62.1,40.52 66.42,40.52 70.99,45.09 89.86,45.09 DEBUG.1
UART_RX  (via drill 0.35)
  Top 0.152: IC1.41 53.68,40.48 53.87,40.67 53.87,43.88 v52.96,44.79
  Bottom 0.152: v52.96,44.79 53.7,45.52 53.7,47.71 57.44,51.45 86.49,51.45 86.79,51.14 UART.1
UART_TX  (via drill 0.35)
  Top 0.152: IC1.40 54.08,40.45 54.17,40.55 54.17,44.49 v53.87,44.79
  Bottom 0.152: v53.87,44.79 54,44.92 54,47.58 57.56,51.14 86.36,51.14 88.9,48.6 UART.2

### Text on the board
Top: BACK
Bottom: Raspberry Pi Pico N64 cartridge v2 / pdaXrom.org, 2022 | FRONT
bPlace: RX | TX | GND | SWD | GND | SWCLK